# EAGLE design Relay_Control (EAGLE 9.6.1)
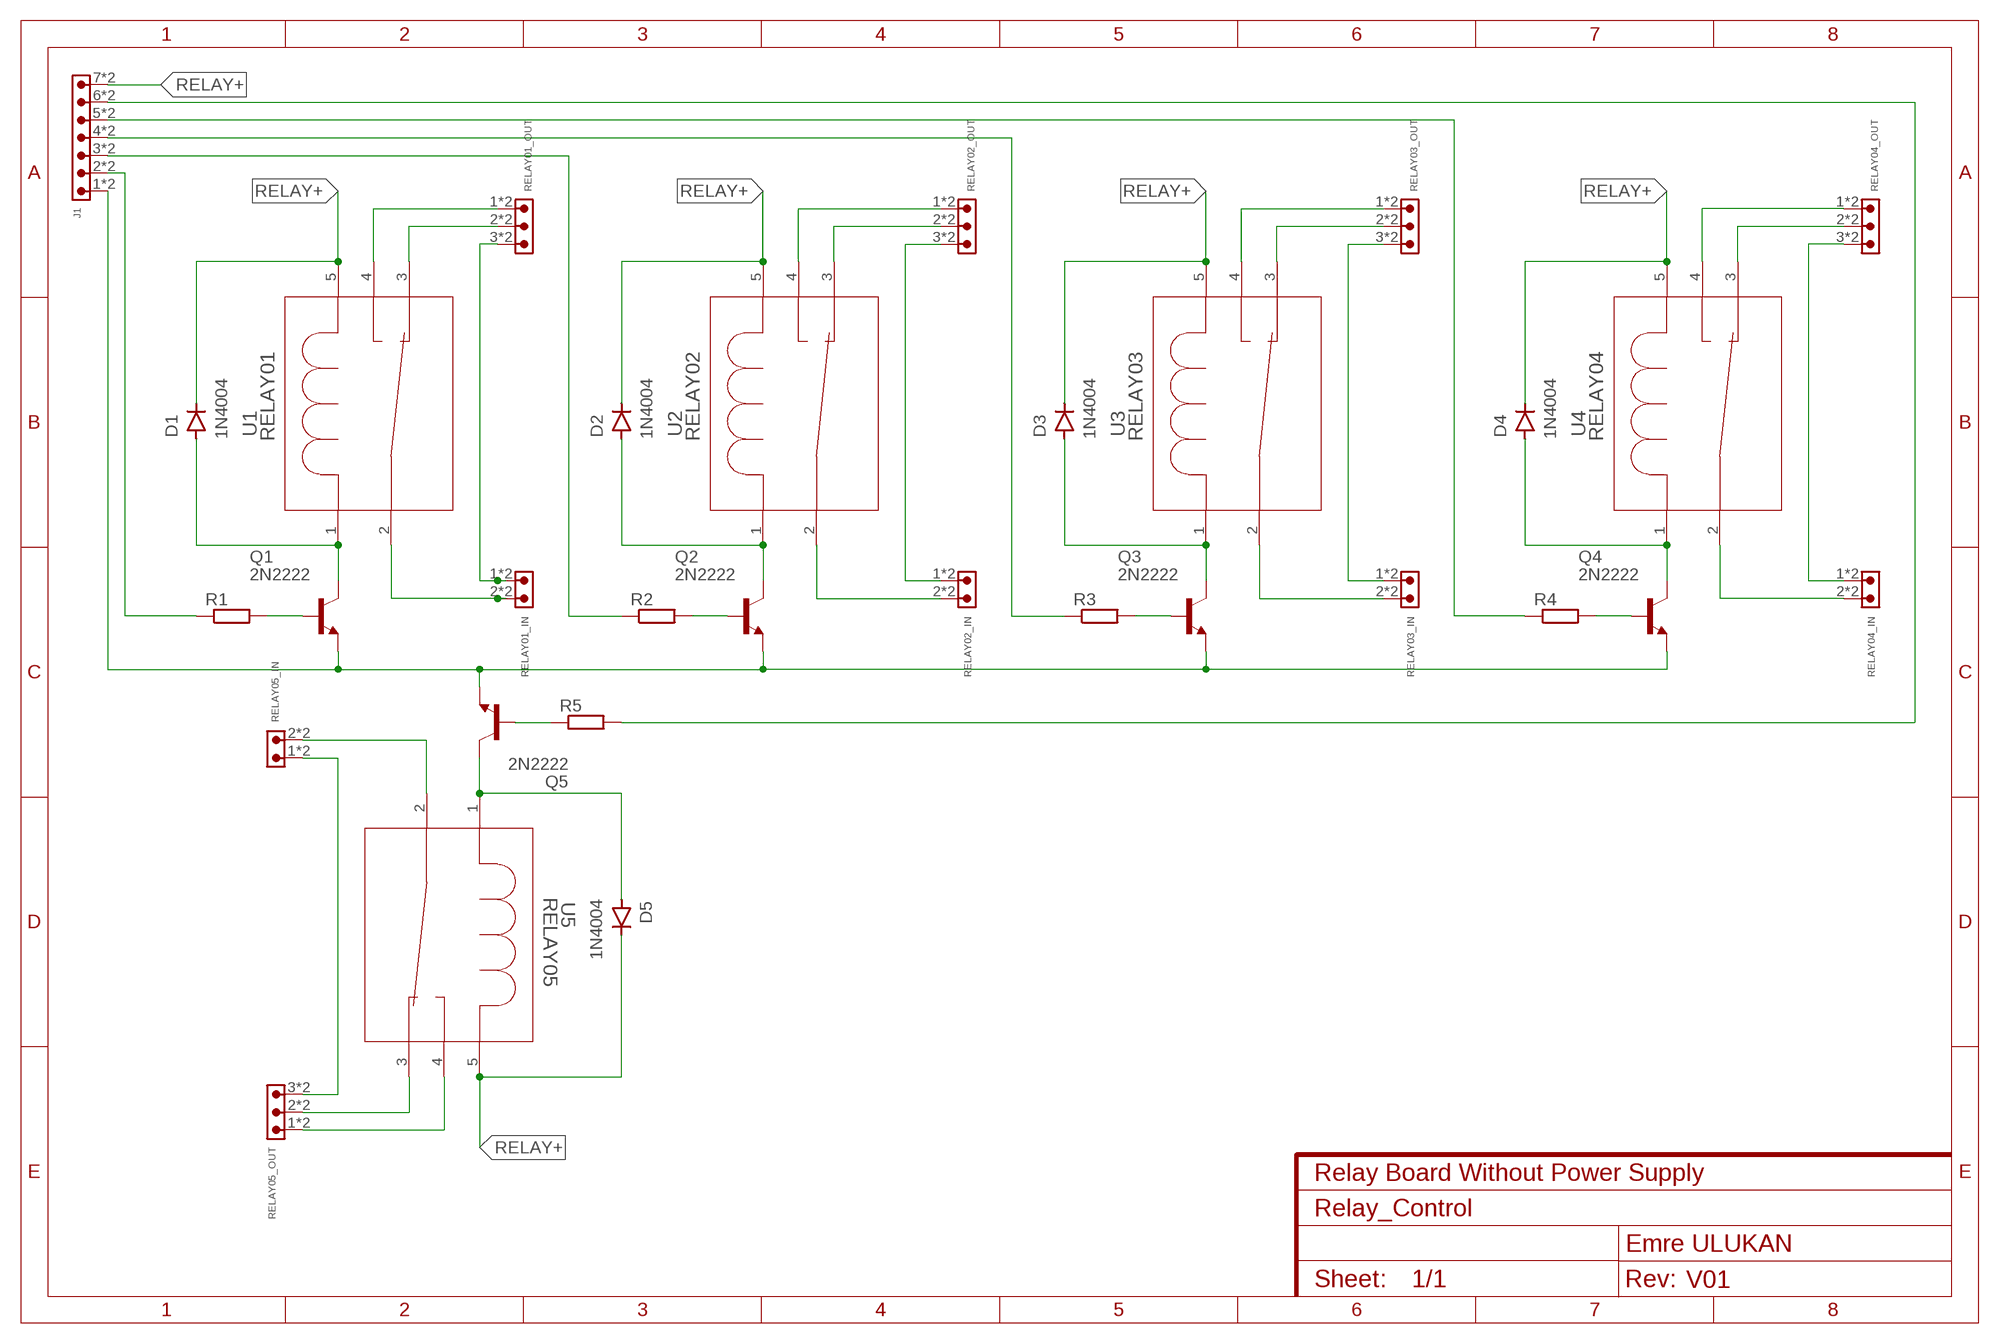
[diagram p0: schematic, sheet 1]
FRAME1 (FRAME-A4L): CNAME: Relay Board Without Power Supply; CREVISION: V01; DESIGNER: Emre ULUKAN

## Parts
D1  1N4004  [DO-41]
D2  1N4004  [DO-41]
D3  1N4004  [DO-41]
D4  1N4004  [DO-41]
D5  1N4004  [DO-41]
J1  638263222007  [638263222007]
Q1  2N2222  [TO18]
Q2  2N2222  [TO18]
Q3  2N2222  [TO18]
Q4  2N2222  [TO18]
Q5  2N2222  [TO18]
R1  R-EU_0207/10  [0207/10]
R2  R-EU_0207/10  [0207/10]
R3  R-EU_0207/10  [0207/10]
R4  R-EU_0207/10  [0207/10]
R5  R-EU_0207/10  [0207/10]
RELAY01_IN  638263222002  [638263222002]
RELAY01_OUT  638263222003  [638263222003]
RELAY02_IN  638263222002  [638263222002]
RELAY02_OUT  638263222003  [638263222003]
RELAY03_IN  638263222002  [638263222002]
RELAY03_OUT  638263222003  [638263222003]
RELAY04_IN  638263222002  [638263222002]
RELAY04_OUT  638263222003  [638263222003]
RELAY05_IN  638263222002  [638263222002]
RELAY05_OUT  638263222003  [638263222003]
U1  RELAY01  4-1393224-6  [RELAY-SPDT_3.2MM]
U2  RELAY02  4-1393224-6  [RELAY-SPDT_3.2MM]
U3  RELAY03  4-1393224-6  [RELAY-SPDT_3.2MM]
U4  RELAY04  4-1393224-6  [RELAY-SPDT_3.2MM]
U5  RELAY05  4-1393224-6  [RELAY-SPDT_3.2MM]

## Nets
GND: J1.1 J1.A1 Q1.1(E) Q2.1(E) Q3.1(E) Q4.1(E) Q5.1(E)
N$1: J1.4 J1.A4 R3.1
N$2: D1.A Q1.3(C) U1.1
N$3: Q1.2(B) R1.2
N$5: J1.2 J1.A2 R1.1
N$6: RELAY01_IN.1 RELAY01_IN.A1 RELAY01_OUT.3 RELAY01_OUT.A3
N$7: RELAY01_OUT.1 RELAY01_OUT.A1 U1.4
N$8: RELAY01_OUT.2 RELAY01_OUT.A2 U1.3
N$9: J1.5 J1.A5 R4.1
N$10: RELAY01_IN.2 RELAY01_IN.A2 U1.2
N$11: D2.A Q2.3(C) U2.1
N$12: Q2.2(B) R2.2
N$14: RELAY02_IN.1 RELAY02_IN.A1 RELAY02_OUT.3 RELAY02_OUT.A3
N$15: RELAY02_OUT.1 RELAY02_OUT.A1 U2.4
N$16: RELAY02_OUT.2 RELAY02_OUT.A2 U2.3
N$17: RELAY02_IN.2 RELAY02_IN.A2 U2.2
N$18: J1.3 J1.A3 R2.1
N$19: J1.6 J1.A6 R5.2
N$20: D3.A Q3.3(C) U3.1
N$21: Q3.2(B) R3.2
N$23: RELAY03_IN.1 RELAY03_IN.A1 RELAY03_OUT.3 RELAY03_OUT.A3
N$24: RELAY03_OUT.1 RELAY03_OUT.A1 U3.4
N$25: RELAY03_OUT.2 RELAY03_OUT.A2 U3.3
N$26: RELAY03_IN.2 RELAY03_IN.A2 U3.2
N$29: D4.A Q4.3(C) U4.1
N$30: Q4.2(B) R4.2
N$32: RELAY04_IN.1 RELAY04_IN.A1 RELAY04_OUT.3 RELAY04_OUT.A3
N$33: RELAY04_OUT.1 RELAY04_OUT.A1 U4.4
N$34: RELAY04_OUT.2 RELAY04_OUT.A2 U4.3
N$35: RELAY04_IN.2 RELAY04_IN.A2 U4.2
N$38: D5.A Q5.3(C) U5.1
N$39: Q5.2(B) R5.1
N$41: RELAY05_IN.1 RELAY05_IN.A1 RELAY05_OUT.3 RELAY05_OUT.A3
N$42: RELAY05_OUT.1 RELAY05_OUT.A1 U5.4
N$43: RELAY05_OUT.2 RELAY05_OUT.A2 U5.3
N$44: RELAY05_IN.2 RELAY05_IN.A2 U5.2
RELAY+: D1.C D2.C D3.C D4.C D5.C J1.7 J1.A7 U1.5 U2.5 U3.5 U4.5 U5.5

## Library data of the parts
D1-D5 = Diodes:1N4004: DIODE GEN PURP 400V 1A DO41 Manufacturer's datasheet <https://www.mccsemi.com/pdf/Products/1N4001-1N4007(DO-41).pdf>; CREATED_BY: PCBLayout.com; DIGIKEY_PART_NUMBER: 1N4004MSCT-ND; MANUFACTURER: Micro Commercial Co; MPN: 1N4004; PACKAGE: DO-41
J1 = Wurth_Connectors_WR-FAST:638263222007: 5.08 mm THT Male Header Vertical Blade 2863 KIND PROPERTIES Pitch 5.08 mm Gender Male MATERIAL PROPERTIES Insulator Material PC Insulator Flammability Rating UL94 V-0 Insulator Color Black Contact Material Steel Contact Plating Tin Contact Type Stamped GENERAL INFORMATION Operating Temperature -30 up to +120 °C Working Voltage 300 V (AC) Withstanding Voltage 1600 V (AC) Contact Resistance 20 mΩ RISO 5 MΩ IR 16 A CERTIFICATION cULus Approval E150931 PACKAGING PROPERTIES Packaging Box <https://katalog.we-online.com/media/images/v2/o161716v209%20Family_ConFAST_638207222004.jpg> Details see: https://katalog.we-online.com/en/em/FAST_5_08_THT_MALE_VERTICAL_6382632220XX Created by Ella Wu 2019-09-05 2019(C) Wurth Elektronik; CONTACT-RESISTANCE: 20mOhm; DATASHEET-URL: https://katalog.we-online.com/em/datasheet/638263222007.pdf; GENDER: Male; IR: 16A; MOUNT: THT; PART-NUMBER: 638263222007; PINS: 7; PITCH: 5.08mm; TYPE: Vertical; WORKING-VOLTAGE: 300V(AC)
Q1-Q5 = transistor-npn:2N2222*: NPN Transistor
R1-R5 = rcl:R-EU_: RESISTOR, European symbol; SPICEPREFIX: R
RELAY01_IN RELAY02_IN RELAY03_IN RELAY04_IN RELAY05_IN = Wurth_Connectors_WR-FAST:638263222002: 5.08 mm THT Male Header Vertical Blade 2863 KIND PROPERTIES Pitch 5.08 mm Gender Male MATERIAL PROPERTIES Insulator Material PC Insulator Flammability Rating UL94 V-0 Insulator Color Black Contact Material Steel Contact Plating Tin Contact Type Stamped GENERAL INFORMATION Operating Temperature -30 up to +120 °C Working Voltage 300 V (AC) Withstanding Voltage 1600 V (AC) Contact Resistance 20 mΩ RISO 5 MΩ IR 16 A CERTIFICATION cULus Approval E150931 PACKAGING PROPERTIES Packaging Box <https://katalog.we-online.com/media/images/v2/o161716v209%20Family_ConFAST_638207222004.jpg> Details see: https://katalog.we-online.com/en/em/FAST_5_08_THT_MALE_VERTICAL_6382632220XX Created by Ella Wu 2019-09-05 2019(C) Wurth Elektronik; CONTACT-RESISTANCE: 20mOhm; DATASHEET-URL: https://katalog.we-online.com/em/datasheet/638263222002.pdf; GENDER: Male; IR: 16A; MOUNT: THT; PART-NUMBER: 638263222002; PINS: 2; PITCH: 5.08mm; TYPE: Vertical; WORKING-VOLTAGE: 300V(AC)
RELAY01_OUT RELAY02_OUT RELAY03_OUT RELAY04_OUT RELAY05_OUT = Wurth_Connectors_WR-FAST:638263222003: 5.08 mm THT Male Header Vertical Blade 2863 KIND PROPERTIES Pitch 5.08 mm Gender Male MATERIAL PROPERTIES Insulator Material PC Insulator Flammability Rating UL94 V-0 Insulator Color Black Contact Material Steel Contact Plating Tin Contact Type Stamped GENERAL INFORMATION Operating Temperature -30 up to +120 °C Working Voltage 300 V (AC) Withstanding Voltage 1600 V (AC) Contact Resistance 20 mΩ RISO 5 MΩ IR 16 A CERTIFICATION cULus Approval E150931 PACKAGING PROPERTIES Packaging Box <https://katalog.we-online.com/media/images/v2/o161716v209%20Family_ConFAST_638207222004.jpg> Details see: https://katalog.we-online.com/en/em/FAST_5_08_THT_MALE_VERTICAL_6382632220XX Created by Ella Wu 2019-09-05 2019(C) Wurth Elektronik; CONTACT-RESISTANCE: 20mOhm; DATASHEET-URL: https://katalog.we-online.com/em/datasheet/638263222003.pdf; GENDER: Male; IR: 16A; MOUNT: THT; PART-NUMBER: 638263222003; PINS: 3; PITCH: 5.08mm; TYPE: Vertical; WORKING-VOLTAGE: 300V(AC)
U1-U5 = Relays:4-1393224-6; BUILT_BY: EMA_UL_Team; CATEGORY: Power Relays; COPYRIGHT: Copyright (C) 2016 Accelerated Designs. All rights reserved; DESCRIPTION: RY211012; MANUFACTURER_PART_NUMBER: RY211012; PART_STATUS: active; SERIES: Unknown; VENDOR: TE Connectivity

## Board
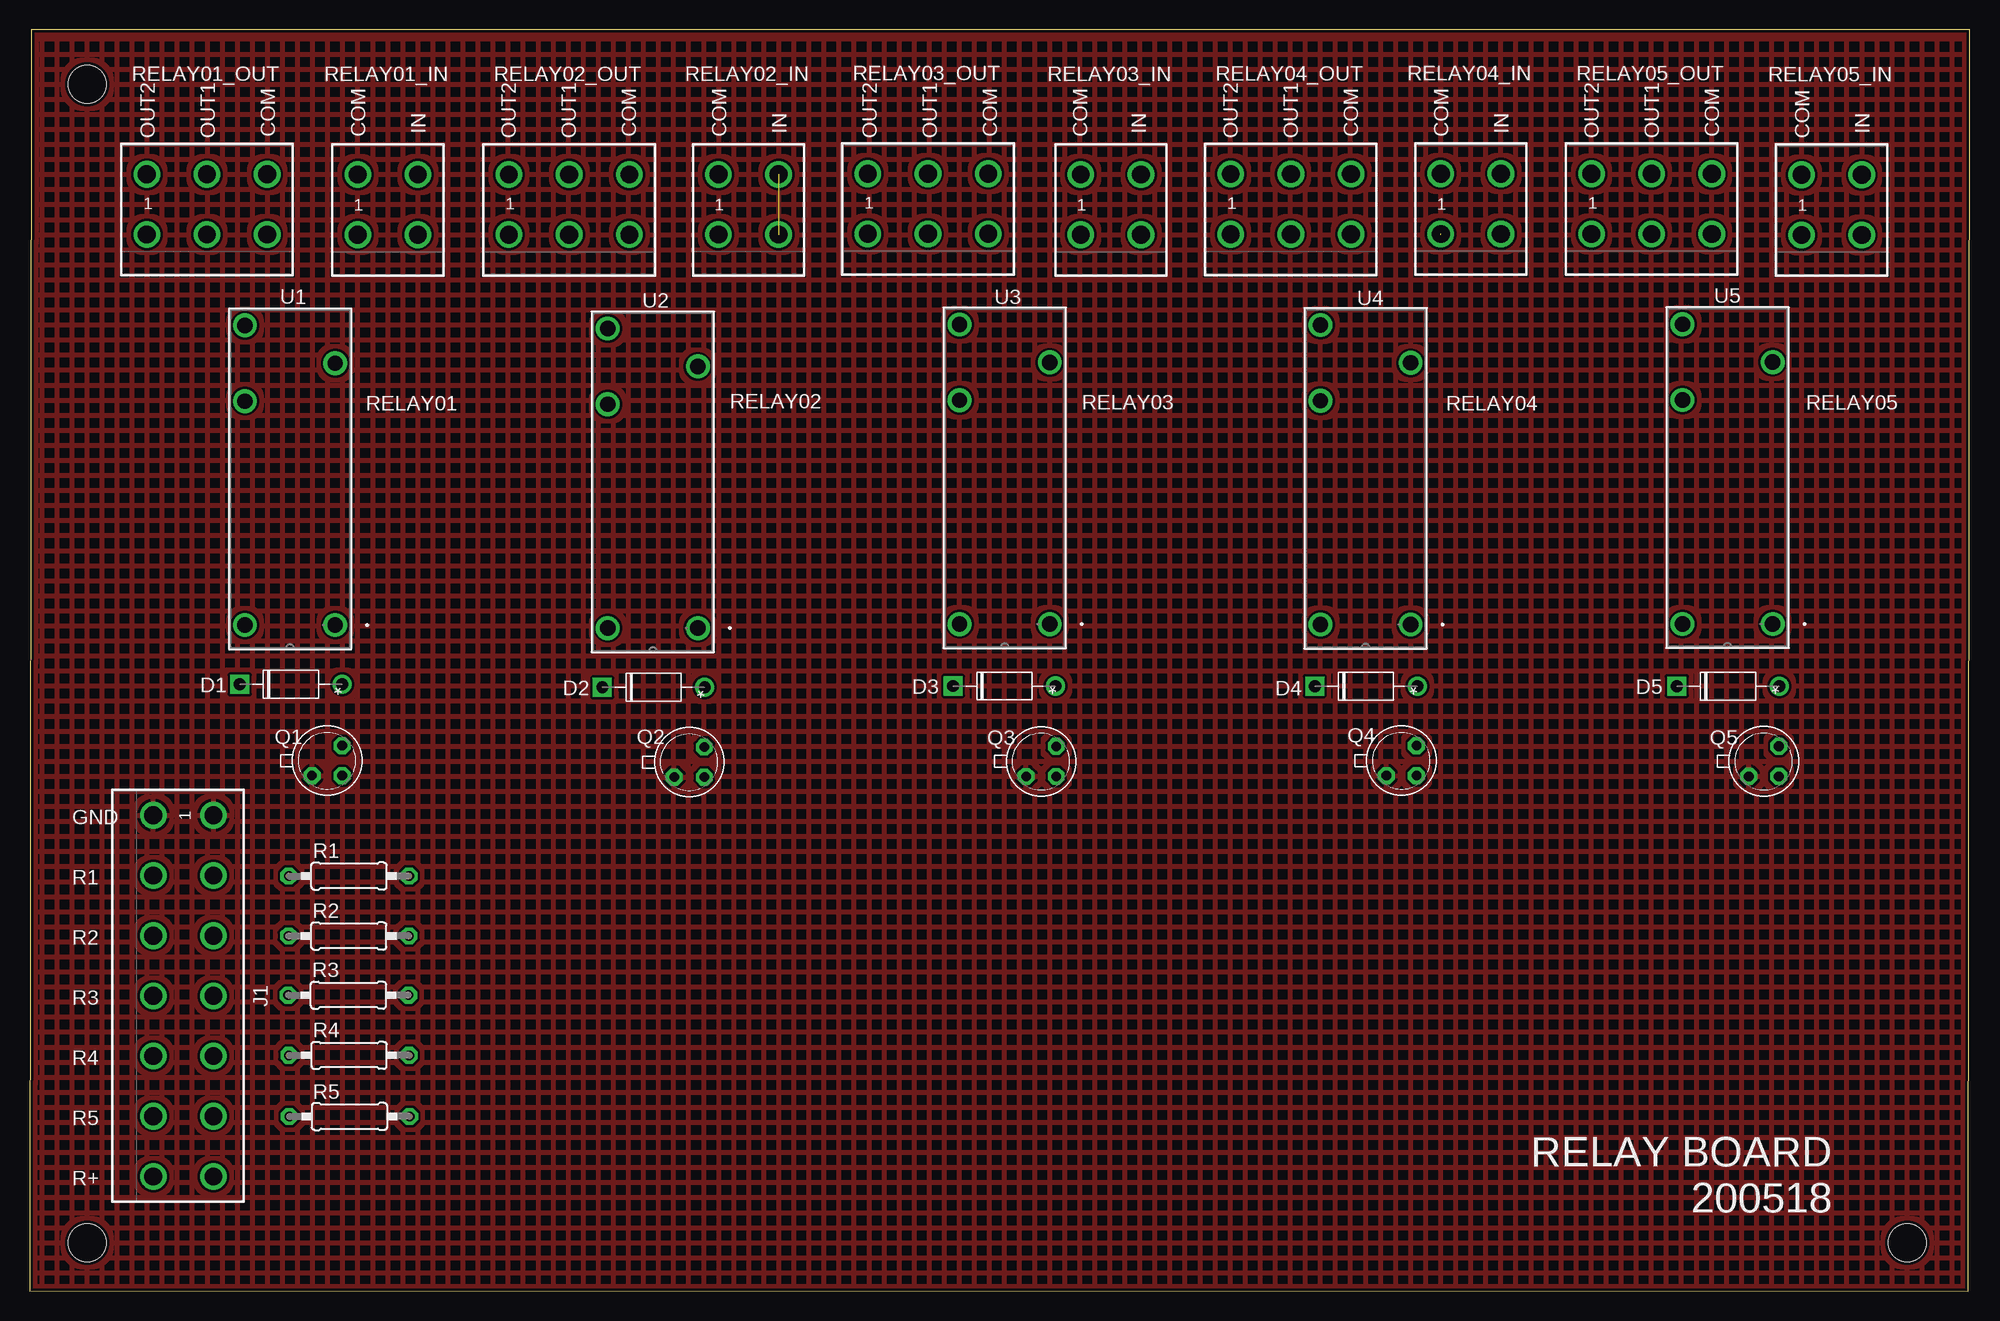
[diagram p1: board, top side]
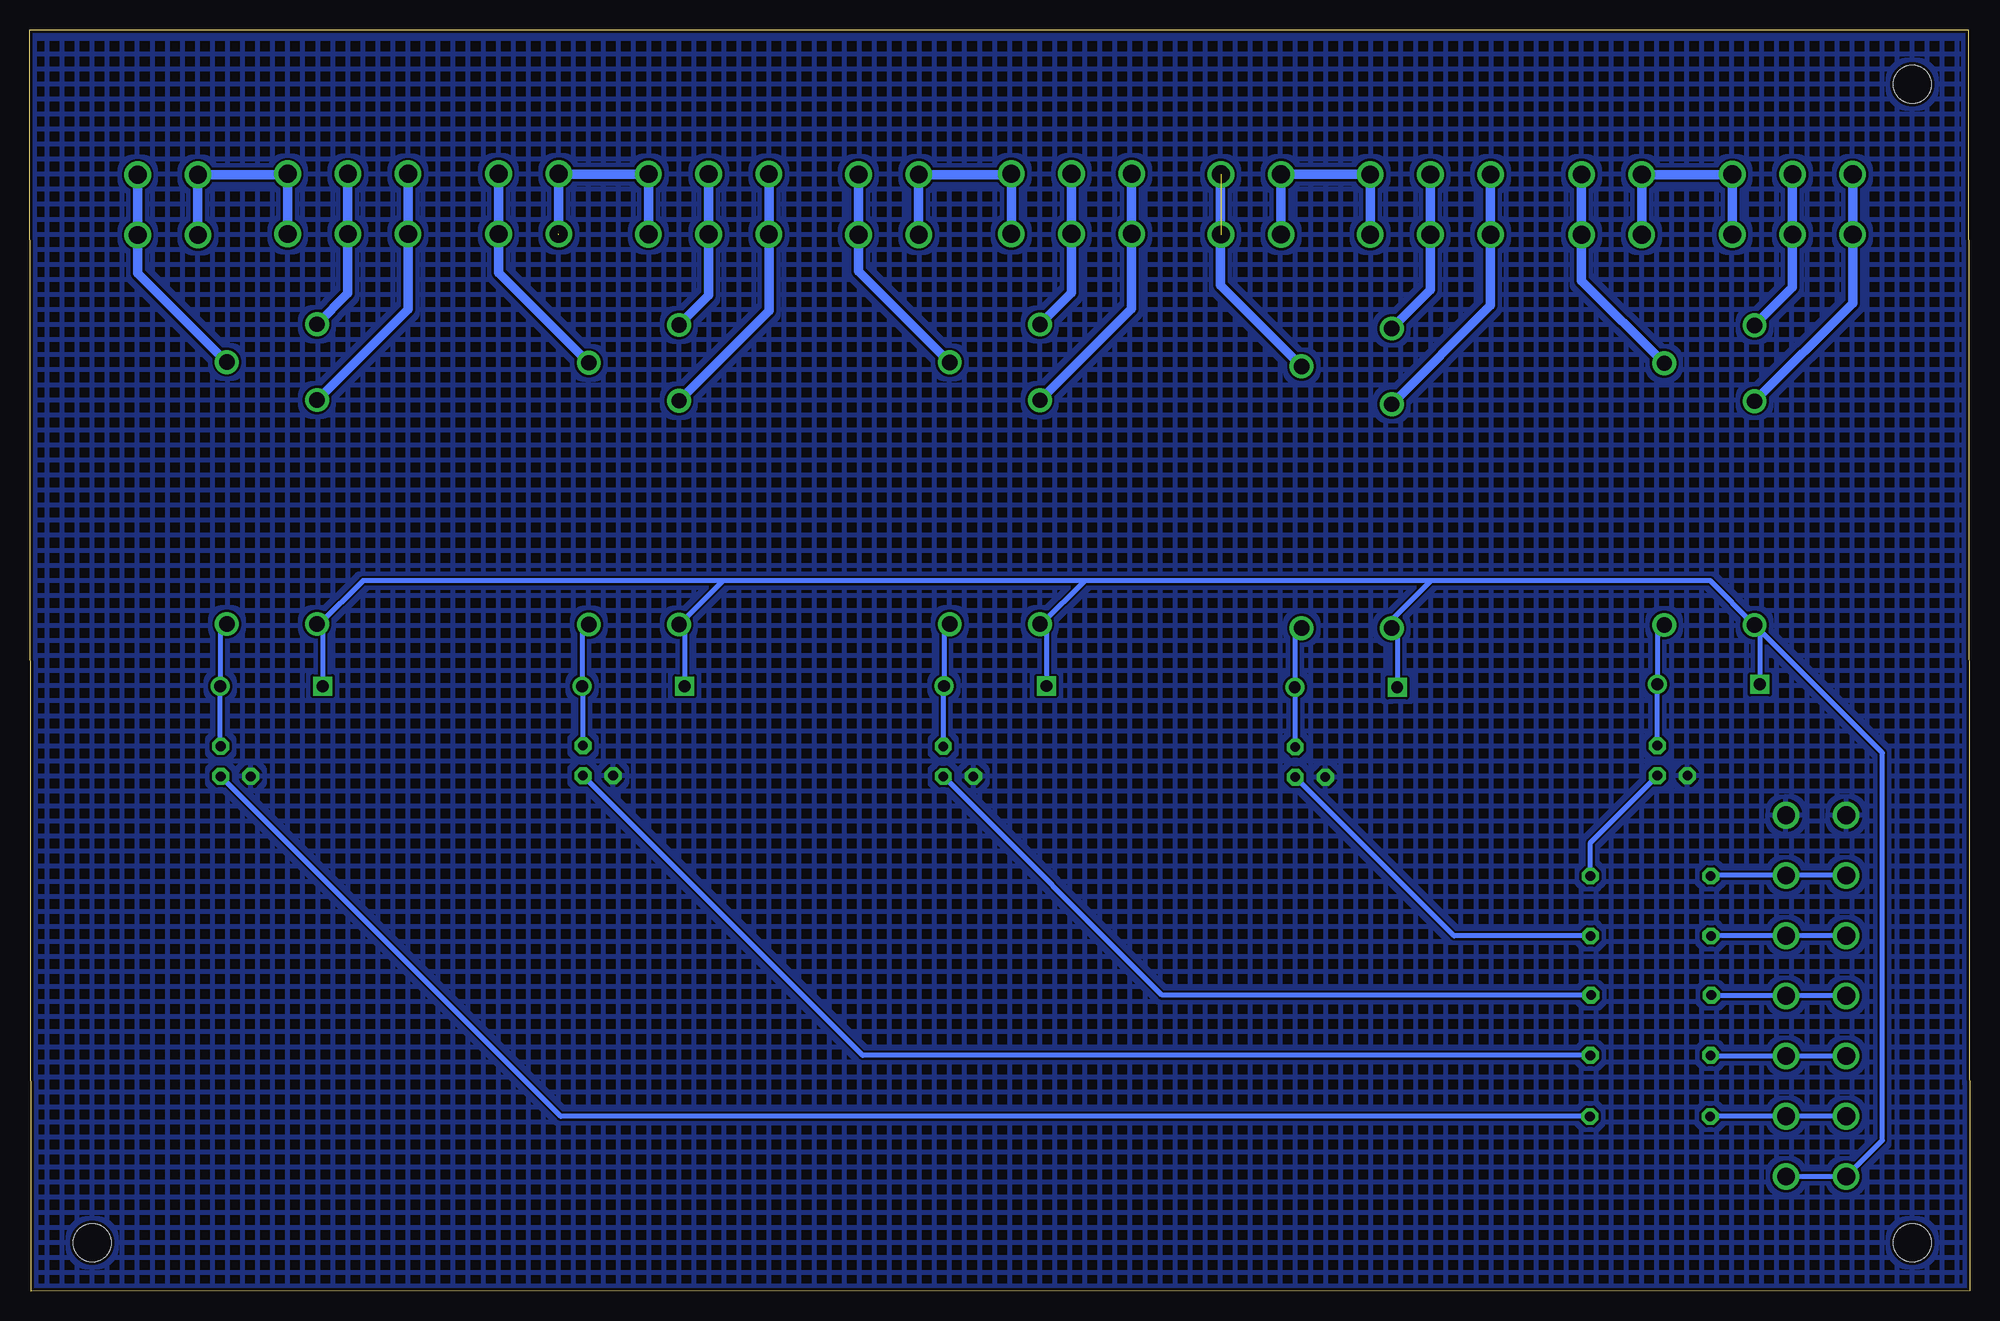
[diagram p2: board, bottom side, seen from below]

Size 163.82 x 106.48 mm. Coordinates in mm from the lower left corner, seen from the top.
Outline: 0,0.01 163.69,0 163.82,106.47 0.13,106.48 0,0.01
Copper layers (1*16): Top 0.035mm / dielectric 1.5mm / Bottom 0.035mm
Design rules "SparkFun": minimum track width 8mil, minimum drill 20mil, track to track 8mil, track to pad 8mil, pad to pad 8mil, via to via 8mil, smd to smd 8mil, copper to edge 10mil, drill to drill 8mil, minimum pad ring 12mil, minimum via ring 10mil, stop-mask expansion 4mil, vias tented up to drill 25mil, thermal gap 10mil
Holes 3.2 mm at 4.86,101.88 4.86,4.09 158.53,4.09

### Footprints (pad centres in the part's own frame; a part is rotated, then mirrored left to right if it is on the bottom)
DO-41 = drill 1: A 4.325,0 | drill 1 square: C -4.325,0
638263222007 = drill 1.5: 1 -15.24,2.54; 2 -10.16,2.54; 3 -5.08,2.54; 4 0,2.54; 5 5.08,2.54; 6 10.16,2.54; 7 15.24,2.54; A1 -15.24,-2.54; A2 -10.16,-2.54; A3 -5.08,-2.54; A4 0,-2.54; A5 5.08,-2.54; A6 10.16,-2.54; A7 15.24,-2.54
TO18 = drill 0.813 octagon: 1 -1.27,-1.27; 2 1.27,-1.27; 3 1.27,1.27
0207/10 = drill 0.813 octagon: 1 -5.08,0; 2 5.08,0
638263222002 = drill 1.5: 1 -2.54,2.54; 2 2.54,2.54; A1 -2.54,-2.54; A2 2.54,-2.54
638263222003 = drill 1.5: 1 -5.08,2.54; 2 0,2.54; 3 5.08,2.54; A1 -5.08,-2.54; A2 0,-2.54; A3 5.08,-2.54
RELAY-SPDT_3.2MM = drill 1.295 pad 2.007: 1 -7.62,24.689; 2 -7.62,2.591; 3 0,-0.61; 4 0,5.791; 5 0,24.689

### Placement (x,y rotation side)
D1  22.06,51.21 0 top
D2  52.68,50.96 0 top
D3  82.3,51.07 0 top
D4  112.84,51.07 0 top
D5  143.4,51.06 0 top
J1  12.98,24.92 270 top
Q1  25.12,44.77 0 top
Q2  55.69,44.65 0 top
Q3  85.4,44.71 0 top
Q4  115.83,44.77 0 top
Q5  146.42,44.71 0 top
R1  26.96,35.03 0 top
R2  26.95,29.97 0 top
R3  26.91,24.98 0 top
R4  26.97,19.9 0 top
R5  27,14.74 180 top
RELAY01_IN  30.24,91.71 0 top
RELAY01_OUT  14.98,91.73 0 top
RELAY02_IN  60.7,91.72 0 top
RELAY02_OUT  45.55,91.72 0 top
RELAY03_IN  91.3,91.71 0 top
RELAY03_OUT  75.85,91.78 0 top
RELAY04_IN  121.69,91.78 0 top
RELAY04_OUT  106.49,91.75 0 top
RELAY05_IN  152.16,91.68 0 top
RELAY05_OUT  136.95,91.77 0 top
U1  18.18,80.91 180 top
U2  48.81,80.65 180 top
U3  78.52,80.98 180 top
U4  108.99,80.94 180 top
U5  139.55,81 180 top

### Tracks (layer width: path | path; a pad name or v marks a point on that pad's centre or on a via)
GND
  pour Top (hatched): -0.22,0.28 163.61,0.28 163.61,106.96 -0.22,106.96
  pour Bottom (hatched): -0.22,0.28 163.61,0.28 163.61,106.96 -0.22,106.96
N$1
  Bottom 0.406: J1.A4 J1.4 21.78,24.92 R3.1
N$2
  Bottom 0.406: U1.1 26.39,55.63 D1.A Q1.3
N$3
  Bottom 0.406: R1.2 32.04,37.85 Q1.2
N$5
  Bottom 0.406: J1.A2 J1.2 21.84,35.08 R1.1
N$6
  Bottom 0.813: RELAY01_OUT.A3 RELAY01_OUT.3 20.08,94.25 RELAY01_IN.1 RELAY01_IN.A1
N$7
  Bottom 0.813: U1.4 9.9,83.4 RELAY01_OUT.A1 RELAY01_OUT.1
N$8
  Bottom 0.813: RELAY01_OUT.2 RELAY01_OUT.A2 14.98,84.72 U1.3
N$9
  Bottom 0.406: J1.A5 J1.5 21.83,19.84 R4.1
N$10
  Bottom 0.813: U1.2 32.78,85.3 RELAY01_IN.A2 RELAY01_IN.2
N$11
  Bottom 0.406: U2.1 57,55.38 57,51.08 | 57,51.08 D2.A | Q2.3 56.96,51.04 57,51.08
N$12
  Bottom 0.406: R2.2 43.55,29.97 Q2.2
N$14
  Bottom 0.813: RELAY02_OUT.A3 RELAY02_OUT.3 RELAY02_IN.1 RELAY02_IN.A1
N$15
  Bottom 0.813: RELAY02_OUT.1 RELAY02_OUT.A1 40.47,83.19 U2.4
N$16
  Bottom 0.813: RELAY02_OUT.2 RELAY02_OUT.A2 45.55,84.51 U2.3
N$17  (1 unrouted)
  Bottom 0.813: RELAY02_IN.2 63.28,94.22 63.28,84.9 U2.2
N$18
  Bottom 0.406: J1.A3 J1.3 21.84,30 R2.1
N$19
  Bottom 0.406: J1.A6 J1.6 21.9,14.76 R5.2
N$20
  Bottom 0.406: U3.1 86.62,55.81 D3.A 86.67,51.02 Q3.3
N$21
  Bottom 0.406: R3.2 68.21,24.98 Q3.2
N$23
  Bottom 0.813: RELAY03_OUT.A3 RELAY03_OUT.3 81.01,94.25 RELAY03_IN.1 RELAY03_IN.A1
N$24
  Bottom 0.813: RELAY03_OUT.1 RELAY03_OUT.A1 70.77,82.94 U3.4
N$25
  Bottom 0.813: RELAY03_OUT.2 RELAY03_OUT.A2 75.85,84.26 U3.3
N$26
  Bottom 0.813: RELAY03_IN.2 RELAY03_IN.A2 93.84,86.09 U3.2
N$29
  Bottom 0.406: U4.1 117.16,55.7 D4.A 117.1,51 Q4.3
N$30
  Bottom 0.406: R4.2 93.49,19.9 Q4.2
N$32  (1 unrouted)
  Bottom 0.813: RELAY04_OUT.A3 RELAY04_OUT.3 119.12,94.29 RELAY04_IN.1 119.15,89.19 119.16,89.18
N$33
  Bottom 0.813: RELAY04_OUT.1 RELAY04_OUT.A1 101.41,82.73 U4.4
N$34
  Bottom 0.813: RELAY04_OUT.2 RELAY04_OUT.A2 106.49,84.05 U4.3
N$35
  Bottom 0.813: RELAY04_IN.2 RELAY04_IN.A2 124.23,85.97 U4.2
N$38
  Bottom 0.406: U5.1 147.73,55.76 147.73,51.08 D5.A 147.73,46.02 Q5.3
N$39
  Bottom 0.406: R5.1 118.98,14.74 Q5.2
N$41
  Bottom 0.813: RELAY05_OUT.A3 RELAY05_OUT.3 142.12,94.22 RELAY05_IN.1 RELAY05_IN.A1
N$42
  Bottom 0.813: RELAY05_OUT.1 RELAY05_OUT.A1 131.87,82.89 U5.4
N$43
  Bottom 0.813: RELAY05_OUT.2 RELAY05_OUT.A2 136.95,84.21 U5.3
N$44
  Bottom 0.813: RELAY05_IN.2 RELAY05_IN.A2 154.69,85.93 U5.2
RELAY+
  Bottom 0.406: 17.74,55.77 U1.5 21.94,59.97 45.5,59.97 | 17.74,55.77 D1.C | D2.C 48.35,55.5 U2.5 48.81,56.66 45.5,59.97 | U3.5 78.45,56.23 | 78.45,56.23 77.97,55.75 D3.C | D4.C 108.51,55.78 U4.5 105.27,59.97 | U5.5 139.44,56.2 | 139.44,56.2 139.08,55.84 D5.C | J1.7 J1.A7 7.4,12.73 7.4,45.43 17.74,55.77 | 45.5,59.97 74.71,59.97 | 74.71,59.97 78.45,56.23 | 74.71,59.97 105.27,59.97 | 105.27,59.97 135.67,59.97 139.44,56.2

### Text on the board
tPlace: OUT2 | OUT1 | COM | COM | IN | OUT2 | OUT1 | COM | COM | IN | OUT2 | OUT1 | COM | COM | IN | OUT2 | OUT1 | COM | COM | IN | OUT2 | OUT1 | COM | COM | IN | GND | R1 | R2 | R3 | R4 | R5 | R+
tNames: RELAY BOARD / 200518